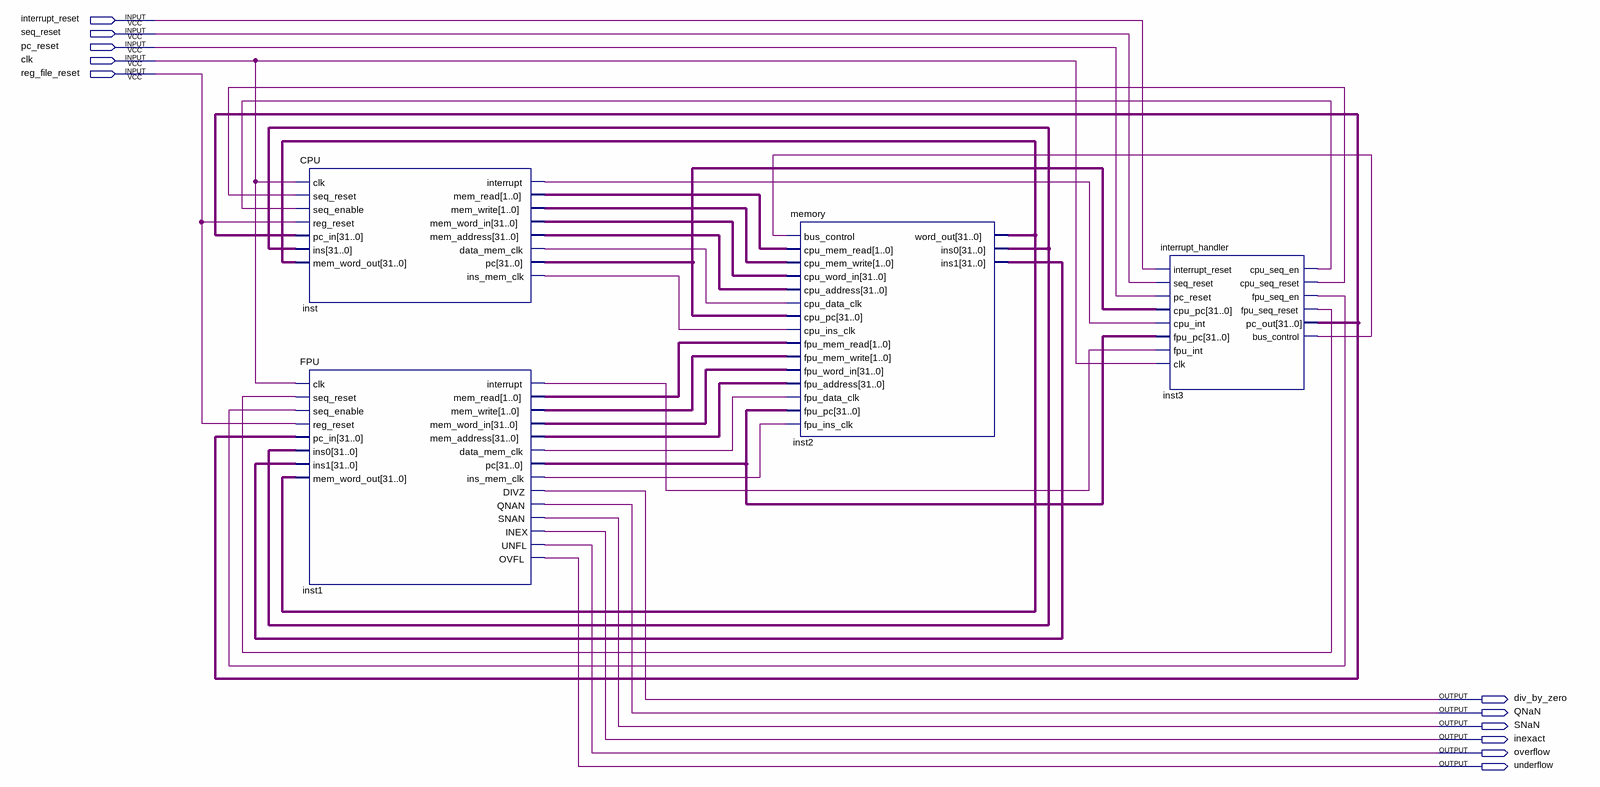
[diagram p0: schematic sheet]
// Quartus schematic machine.bdf as structural Verilog: 4 symbols, 11 pins
module machine (
  input  interrupt_reset,
  input  seq_reset,
  input  pc_reset,
  input  clk,
  input  reg_file_reset,
  output div_by_zero,
  output QNaN,
  output SNaN,
  output inexact,
  output overflow,
  output underflow
);

  wire inst1_data_mem_clk, inst1_ins_mem_clk, inst1_interrupt, inst3_bus_control, inst3_cpu_seq_en,
       inst3_cpu_seq_reset, inst3_fpu_seq_en, inst3_fpu_seq_reset, inst_data_mem_clk, inst_ins_mem_clk,
       inst_interrupt;
  wire [1:0] inst1_mem_read, inst1_mem_write, inst_mem_read, inst_mem_write;
  wire [31:0] inst1_mem_address, inst1_mem_word_in, inst1_pc, inst2_ins0, inst2_ins1, inst2_word_out,
       inst3_pc_out, inst_mem_address, inst_mem_word_in, inst_pc;

  CPU inst (
    .clk(clk), .seq_reset(inst3_cpu_seq_reset), .seq_enable(inst3_cpu_seq_en), .reg_reset(reg_file_reset),
    .pc_in(inst3_pc_out), .ins(inst2_ins0), .mem_word_out(inst2_word_out), .interrupt(inst_interrupt),
    .mem_read(inst_mem_read), .mem_write(inst_mem_write), .mem_word_in(inst_mem_word_in),
    .mem_address(inst_mem_address), .data_mem_clk(inst_data_mem_clk), .pc(inst_pc),
    .ins_mem_clk(inst_ins_mem_clk));
  FPU inst1 (
    .clk(clk), .seq_reset(inst3_fpu_seq_reset), .seq_enable(inst3_fpu_seq_en), .reg_reset(reg_file_reset),
    .pc_in(inst3_pc_out), .ins0(inst2_ins0), .ins1(inst2_ins1), .mem_word_out(inst2_word_out),
    .interrupt(inst1_interrupt), .mem_read(inst1_mem_read), .mem_write(inst1_mem_write),
    .mem_word_in(inst1_mem_word_in), .mem_address(inst1_mem_address), .data_mem_clk(inst1_data_mem_clk),
    .pc(inst1_pc), .ins_mem_clk(inst1_ins_mem_clk), .DIVZ(div_by_zero), .QNAN(QNaN), .SNAN(SNaN),
    .INEX(inexact), .UNFL(overflow), .OVFL(underflow));
  memory inst2 (
    .bus_control(inst3_bus_control), .cpu_mem_read(inst_mem_read), .cpu_mem_write(inst_mem_write),
    .cpu_word_in(inst_mem_word_in), .cpu_address(inst_mem_address), .cpu_data_clk(inst_data_mem_clk),
    .cpu_pc(inst_pc), .cpu_ins_clk(inst_ins_mem_clk), .fpu_mem_read(inst1_mem_read),
    .fpu_mem_write(inst1_mem_write), .fpu_word_in(inst1_mem_word_in), .fpu_address(inst1_mem_address),
    .fpu_data_clk(inst1_data_mem_clk), .fpu_pc(inst1_pc), .fpu_ins_clk(inst1_ins_mem_clk),
    .word_out(inst2_word_out), .ins0(inst2_ins0), .ins1(inst2_ins1));
  interrupt_handler inst3 (
    .interrupt_reset(interrupt_reset), .seq_reset(seq_reset), .pc_reset(pc_reset), .cpu_pc(inst_pc),
    .cpu_int(inst_interrupt), .fpu_pc(inst1_pc), .fpu_int(inst1_interrupt), .clk(clk),
    .cpu_seq_en(inst3_cpu_seq_en), .cpu_seq_reset(inst3_cpu_seq_reset), .fpu_seq_en(inst3_fpu_seq_en),
    .fpu_seq_reset(inst3_fpu_seq_reset), .pc_out(inst3_pc_out), .bus_control(inst3_bus_control));
endmodule
